# Altium schematic sheet Mako DSP MIDI.SchDoc
size A
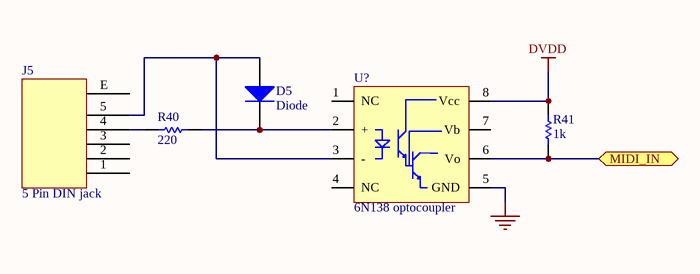
[diagram p0: Mako DSP MIDI.SchDoc]

## Parts
D5  Diode  [SMT diode]
J5  5 Pin DIN jack  [Kobiconn 5 pin DIN]
R40  value 220  [SM 0805 - gap trimmed]  (hidden comment: res 220)
R41  value 1k  [SM 0603]  (hidden comment: res 1k)
U?  6N138 optocoupler  [DIP8]

## Ports
MIDI_IN

## Nets
DVDD: R41.1 U?.8(Vcc)
GND: U?.5(GND)
MIDI_IN: R41.2 U?.6(Vo) ; port MIDI_IN
NetD5_1: D5.1(A) J5.5(SI) U?.3(-)
NetD5_2: D5.2(K) R40.1 U?.2(+)
NetJ5_4: J5.4(SI) R40.2

Not connected (* = marked no-connect by the designer): J5 1(SI) 2(SI) 3(SI) E(SI); U? 1(NC) 4(NC) 7(Vb)

## Library data of the parts
D5 = Diode: Default Diode; Published: 8-Jun-2000; LatestRevisionDate: 17-Jul-2002; LatestRevisionNote: Re-released for DXP Platform.; Publisher: Altium Limited; Code_JEDEC: DO-214-AB
J5 = Kobiconn 5 pin DIN
R40 R41 = Res1: Resistor; Published: 8-Jun-2000; LatestRevisionDate: 17-Jul-2002; LatestRevisionNote: Re-released for DXP Platform.; Publisher: Altium Limited